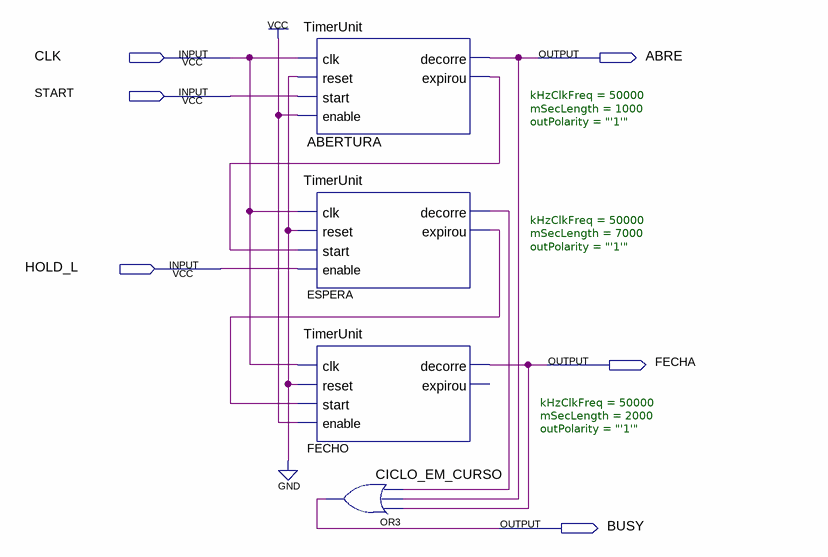
[diagram p0: schematic sheet]
// Quartus schematic Temporiza.bdf as structural Verilog: 4 symbols, 6 pins
module Temporiza (
  input  CLK,
  input  START,
  input  HOLD_L,
  output ABRE,
  output FECHA,
  output BUSY
);

  wire ABERTURA_expirou, ESPERA_decorre, ESPERA_expirou;

  TimerUnit #(.kHzClkFreq(50000), .mSecLength(1000), .outPolarity("'1'")) ABERTURA (
    .clk(CLK), .reset(1'b0), .start(START), .enable(1'b1), .decorre(ABRE), .expirou(ABERTURA_expirou));
  TimerUnit #(.kHzClkFreq(50000), .mSecLength(7000), .outPolarity("'1'")) ESPERA (
    .clk(CLK), .reset(1'b0), .start(ABERTURA_expirou), .enable(HOLD_L), .decorre(ESPERA_decorre),
    .expirou(ESPERA_expirou));
  TimerUnit #(.kHzClkFreq(50000), .mSecLength(2000), .outPolarity("'1'")) FECHO (
    .clk(CLK), .reset(1'b0), .start(ESPERA_expirou), .enable(1'b1), .decorre(FECHA));  // open: expirou
  or CICLO_EM_CURSO (BUSY, FECHA, ABRE, ESPERA_decorre);
endmodule
